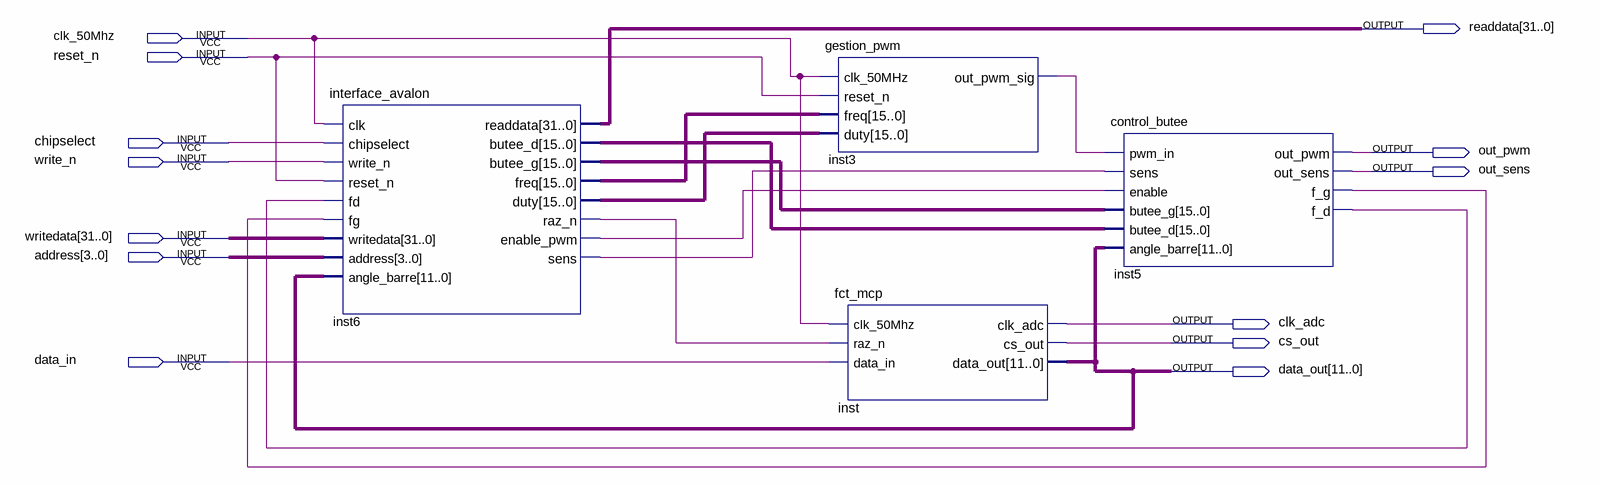
[diagram p0: schematic sheet]
// Quartus schematic systeme_verin.bdf as structural Verilog: 4 symbols, 13 pins
module systeme_verin (
  input  clk_50Mhz,
  input  reset_n,
  input  chipselect,
  input  write_n,
  input  [31:0] writedata,
  input  [3:0] address,
  input  data_in,
  output [31:0] readdata,
  output out_pwm,
  output out_sens,
  output clk_adc,
  output cs_out,
  output [11:0] data_out
);

  wire inst3_out_pwm_sig, inst5_f_d, inst5_f_g, inst6_enable_pwm, inst6_raz_n, inst6_sens;
  wire [15:0] inst6_butee_d, inst6_butee_g, inst6_duty, inst6_freq;

  interface_avalon inst6 (
    .clk(clk_50Mhz), .chipselect(chipselect), .write_n(write_n), .reset_n(reset_n), .fd(inst5_f_d),
    .fg(inst5_f_g), .writedata(writedata), .address(address), .angle_barre(data_out), .readdata(readdata),
    .butee_d(inst6_butee_d), .butee_g(inst6_butee_g), .freq(inst6_freq), .duty(inst6_duty),
    .raz_n(inst6_raz_n), .enable_pwm(inst6_enable_pwm), .sens(inst6_sens));
  gestion_pwm inst3 (
    .clk_50MHz(clk_50Mhz), .reset_n(reset_n), .freq(inst6_freq), .duty(inst6_duty),
    .out_pwm_sig(inst3_out_pwm_sig));
  fct_mcp inst (
    .clk_50Mhz(clk_50Mhz), .raz_n(inst6_raz_n), .data_in(data_in), .clk_adc(clk_adc), .cs_out(cs_out),
    .data_out(data_out));
  control_butee inst5 (
    .pwm_in(inst3_out_pwm_sig), .sens(inst6_sens), .enable(inst6_enable_pwm), .butee_g(inst6_butee_g),
    .butee_d(inst6_butee_d), .angle_barre(data_out), .out_pwm(out_pwm), .out_sens(out_sens), .f_g(inst5_f_g),
    .f_d(inst5_f_d));
endmodule
